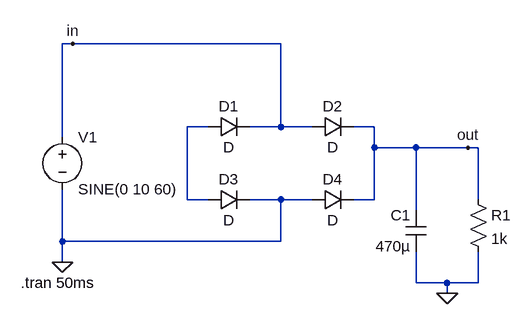
[diagram p0: schematic full-wave rectifier circuit part 3 with DC.asc]
full-wave rectifier circuit part 3 with DC.asc, the LTspice schematic file:
Version 4.1
SHEET 1 880 680
WIRE -48 0 -64 0
WIRE 272 0 -48 0
WIRE 160 128 128 128
WIRE 272 128 272 0
WIRE 272 128 224 128
WIRE 320 128 272 128
WIRE 416 128 384 128
WIRE -64 144 -64 0
WIRE 416 160 416 128
WIRE 480 160 416 160
WIRE 560 160 480 160
WIRE 576 160 560 160
WIRE 128 240 128 128
WIRE 160 240 128 240
WIRE 272 240 224 240
WIRE 320 240 272 240
WIRE 416 240 416 160
WIRE 416 240 384 240
WIRE 576 240 576 160
WIRE 480 256 480 160
WIRE -64 304 -64 224
WIRE 272 304 272 240
WIRE 272 304 -64 304
WIRE -64 336 -64 304
WIRE 480 368 480 320
WIRE 528 368 480 368
WIRE 576 368 576 320
WIRE 576 368 528 368
WIRE 528 384 528 368
FLAG -64 336 0
FLAG 528 384 0
FLAG -48 0 in
FLAG 560 160 out
SYMBOL voltage -64 128 R0
WINDOW 123 0 0 Left 0
WINDOW 39 0 0 Left 0
SYMATTR InstName V1
SYMATTR Value SINE(0 10 60)
SYMBOL diode 160 144 R270
WINDOW 0 32 32 VTop 2
WINDOW 3 0 32 VBottom 2
SYMATTR InstName D1
SYMBOL diode 320 144 R270
WINDOW 0 32 32 VTop 2
WINDOW 3 0 32 VBottom 2
SYMATTR InstName D2
SYMBOL diode 160 256 R270
WINDOW 0 32 32 VTop 2
WINDOW 3 0 32 VBottom 2
SYMATTR InstName D3
SYMBOL diode 320 256 R270
WINDOW 0 32 32 VTop 2
WINDOW 3 0 32 VBottom 2
SYMATTR InstName D4
SYMBOL res 560 224 R0
SYMATTR InstName R1
SYMATTR Value 1k
SYMBOL cap 496 320 R180
WINDOW 0 24 56 Left 2
WINDOW 3 24 8 Left 2
SYMATTR InstName C1
SYMATTR Value 470µ
TEXT -128 368 Left 2 !.tran 50ms

The netlist it stands for:
* full-wave rectifier circuit part 3 with DC.asc
V1 in 0 SINE(0 10 60)
D1 N001 in D
D2 in out D
D3 N001 0 D
D4 0 out D
R1 out 0 1k
C1 0 out 470µ
.model D D
.lib standard.dio
.tran 50ms
.backanno
.end